# Altium project StepperDriverV2.PrjPcb
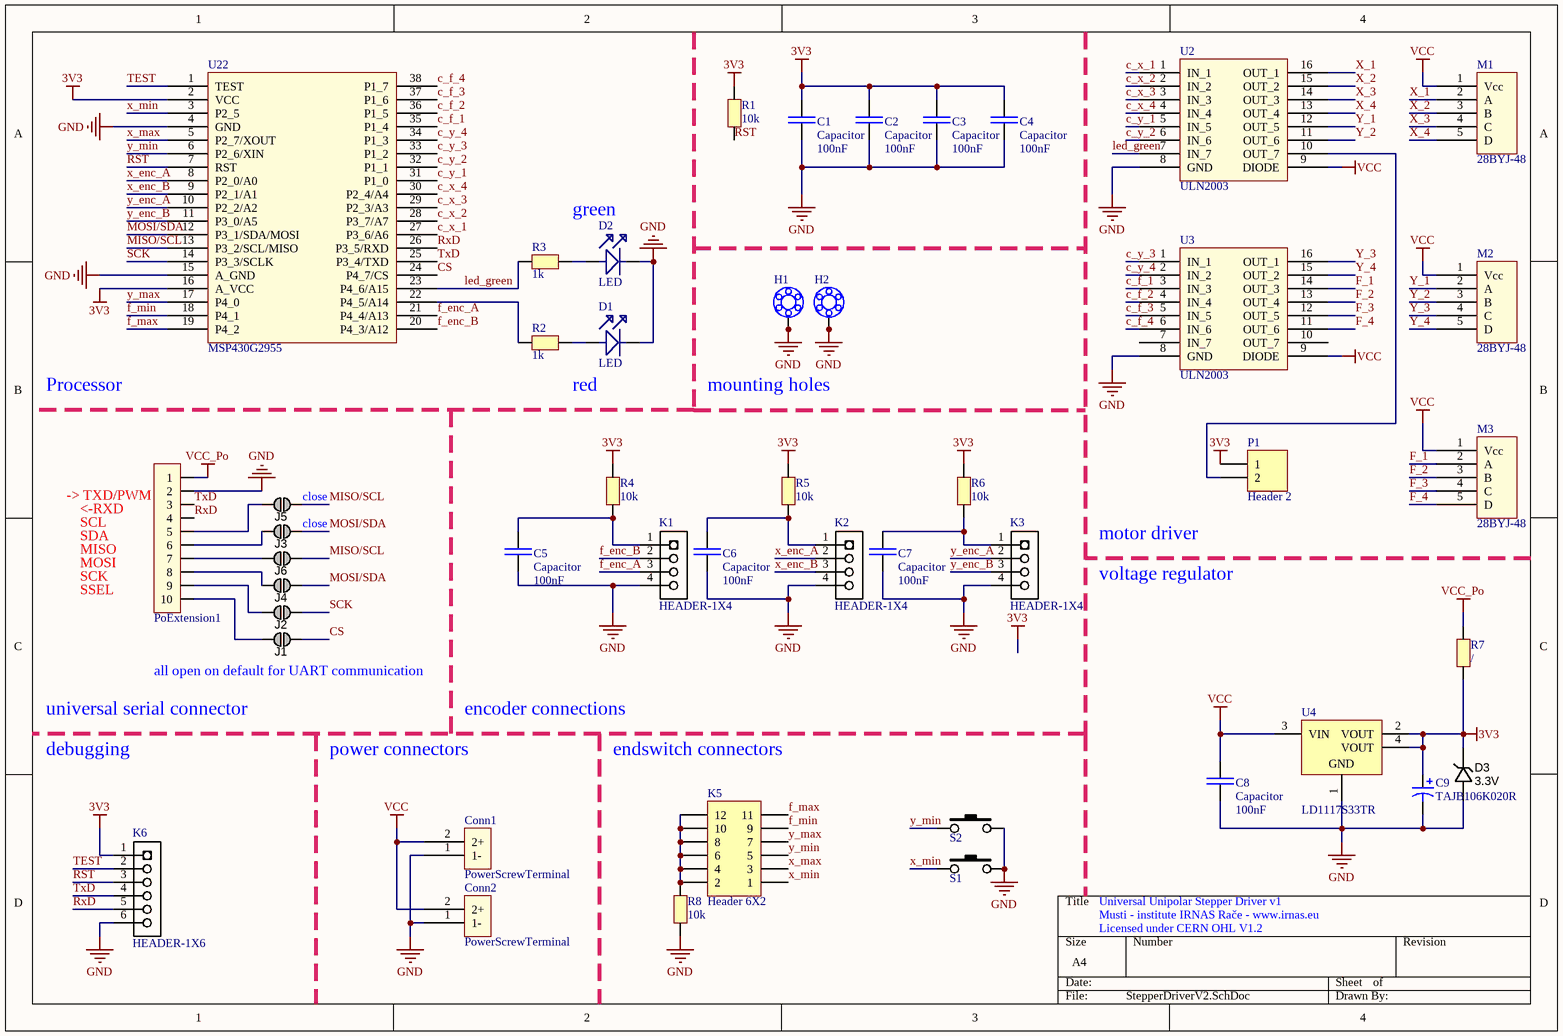
[diagram p0: StepperDriverV2.SchDoc]
1 sheet, 46 parts. Net scope: global (net labels, ports and power ports of the same name join across sheets).
Board file: StepperDriverV2.PcbDoc

## Sheet StepperDriverV2.SchDoc
size A4

### Parts
C1  Capacitor  value 100nF  [0603]
C2  Capacitor  value 100nF  [0603]
C3  Capacitor  value 100nF  [0603]
C4  Capacitor  value 100nF  [0603]
C5  Capacitor  value 100nF  [0603]
C6  Capacitor  value 100nF  [0603]
C7  Capacitor  value 100nF  [0603]
C8  Capacitor  value 100nF  [0603]
C9  TAJB106K020R  [AVX-CAPC3528_V]
Conn1  PowerScrewTerminal  [MKDSN 2,5/ 2-5,08 and powercon]
Conn2  PowerScrewTerminal  [MKDSN 2,5/ 2-5,08 and powercon]
D1  LED  [RESC2012X06N]
D2  LED  [RESC2012X06N]
D3  3.3V  [SOD323]
H1  M  [MOUNTING]  (value not drawn)  (no BOM)
H2  M  [MOUNTING]  (value not drawn)  (no BOM)
J1  Jumper  [JUMP1]  (value not drawn)  (no BOM)
J2  Jumper  [JUMP1]  (value not drawn)  (no BOM)
J3  Jumper  [JUMP1]  (value not drawn)  (no BOM)
J4  Jumper  [JUMP1]  (value not drawn)  (no BOM)
J5  Jumper  [JUMP1]  (value not drawn)  (no BOM)
J6  Jumper  [JUMP1]  (value not drawn)  (no BOM)
K1  HEADER-1X4  [HEADER-1X4]
K2  HEADER-1X4  [HEADER-1X4]
K3  HEADER-1X4  [HEADER-1X4]
K5  Header 6X2  [HDR2X6]
K6  HEADER-1X6  [HEADER-1X6]
M1  28BYJ-48  [XHP-5]
M2  28BYJ-48  [XHP-5]
M3  28BYJ-48  [XHP-5]
P1  Header 2  [HDR1X2]
PoExtension1  (no value)  [8-188275-0]
R1  10k  [0603]
R2  1k  [0603]
R3  1k  [0603]
R4  10k  [0603]
R5  10k  [0603]
R6  10k  [0603]
R7  /  [0603]
R8  10k  [0603]
S1  SW_THT_ANGLE  [TACT_Angle]  (value not drawn)
S2  SW_THT_ANGLE  [TACT_Angle]  (value not drawn)
U2  ULN2003  [SO-16 narrow]
U3  ULN2003  [SO-16 narrow]
U4  LD1117S33TR  [SOT-223_L]
U22  MSP430G2955  [R-PDSO-G38]

### Nets
3V3: C1.1 C2.1 C3.1 C4.1 C9.1 D3.K K6.1 P1.1 R1.2 R4.2 R5.2 R6.2 R7.1 U4.2(VOUT) U4.4(VOUT) U22.2(VCC) U22.16(A_VCC)
GND: C1.2 C2.2 C3.2 C4.2 C5.2 C6.2 C7.2 C8.2 C9.2 Conn1.1(1-) Conn2.1(1-) D1.2 D2.2 D3.A H1.1 H1.2 H1.3 H1.4 H1.5 H1.6 H1.7 H2.1 H2.2 H2.3 H2.4 H2.5 H2.6 H2.7 K1.4 K2.4 K3.4 K6.6 PoExtension1.2 R8.2 S1.2 S2.2 U2.8(GND) U3.8(GND) U4.1(GND) U22.4(GND) U22.15(A_GND)
VCC: C8.1 Conn1.2(2+) Conn2.2(2+) M1.1(Vcc) M2.1(Vcc) M3.1(Vcc) U2.9(DIODE) U3.9(DIODE) U4.3(VIN)
VCC_Po: PoExtension1.1 R7.2
c_f_1: U3.3(IN_3) U22.35(P1_4)
c_f_2: U3.4(IN_4) U22.36(P1_5)
c_f_3: U3.5(IN_5) U22.37(P1_6)
c_f_4: U3.6(IN_6) U22.38(P1_7)
c_x_1: U2.1(IN_1) U22.27(P3_6/A6)
c_x_2: U2.2(IN_2) U22.28(P3_7/A7)
c_x_3: U2.3(IN_3) U22.29(P2_3/A3)
c_x_4: U2.4(IN_4) U22.30(P2_4/A4)
c_y_1: U2.5(IN_5) U22.31(P1_0)
c_y_2: U2.6(IN_6) U22.32(P1_1)
c_y_3: U3.1(IN_1) U22.33(P1_2)
c_y_4: U3.2(IN_2) U22.34(P1_3)
CS: J1.2 U22.24(P4_7/CS)
F_1: M3.2(A) U3.14(OUT_3)
F_2: M3.3(B) U3.13(OUT_4)
F_3: M3.4(C) U3.12(OUT_5)
F_4: M3.5(D) U3.11(OUT_6)
f_enc_A: K1.3 U22.21(P4_4/A13)
f_enc_B: K1.2 U22.20(P4_3/A12)
f_max: K5.11 U22.19(P4_2)
f_min: K5.9 U22.18(P4_1)
led_green: R3.2 U2.7(IN_7) U22.23(P4_6/A15)
MISO/SCL: J5.1 J6.1 U22.13(P3_2/SCL/MISO)
MOSI/SDA: J3.1 J4.1 U22.12(P3_1/SDA/MOSI)
RST: K6.3 R1.1 U22.7(RST)
RxD: K6.5 PoExtension1.4 U22.26(P3_5/RXD)
SCK: J2.2 U22.14(P3_3/SCLK)
TEST: K6.2 U22.1(TEST)
TxD: K6.4 PoExtension1.3 U22.25(P3_4/TXD)
X_1: M1.2(A) U2.16(OUT_1)
X_2: M1.3(B) U2.15(OUT_2)
X_3: M1.4(C) U2.14(OUT_3)
X_4: M1.5(D) U2.13(OUT_4)
x_enc_A: K2.2 U22.8(P2_0/A0)
x_enc_B: K2.3 U22.9(P2_1/A1)
x_max: K5.3 U22.5(P2_7/XOUT)
x_min: K5.1 S1.1 U22.3(P2_5)
Y_1: M2.2(A) U2.12(OUT_5)
Y_2: M2.3(B) U2.11(OUT_6)
Y_3: M2.4(C) U3.16(OUT_1)
Y_4: M2.5(D) U3.15(OUT_2)
y_enc_A: K3.2 U22.10(P2_2/A2)
y_enc_B: K3.3 U22.11(P3_0/A5)
y_max: K5.7 U22.17(P4_0)
y_min: K5.5 S2.1 U22.6(P2_6/XIN)
NetC5_1: C5.1 K1.1 R4.1
NetC6_1: C6.1 K2.1 R5.1
NetC7_1: C7.1 K3.1 R6.1
NetD1_1: D1.1 R2.1
NetD2_1: D2.1 R3.1
NetJ1_1: J1.1 PoExtension1.10
NetJ2_1: J2.1 PoExtension1.9
NetJ3_2: J3.2 PoExtension1.6
NetJ4_2: J4.2 PoExtension1.8
NetJ5_2: J5.2 PoExtension1.5
NetJ6_2: J6.2 PoExtension1.7
NetK5_2: K5.2 K5.4 K5.6 K5.8 K5.10 K5.12 R8.1
NetP1_2: P1.2 U2.10(OUT_7)
NetR2_2: R2.2 U22.22(P4_5/A14)

Not connected (* = marked no-connect by the designer): U3 7(IN_7) 10(OUT_7)

### Notes on the sheet
- green
- Processor
- red
- mounting holes
- (near PoExtension1) -> TXD/PWM
- <-RXD
- (near J5) close
- SCL
- SDA
- MISO
- MOSI
- SCK
- close
- motor driver
- voltage regulator
- SSEL
- universal serial connector
- (near J1) all open on default for UART communication
- encoder connections
- debugging
- power connectors
- endswitch connectors
- Universal Unipolar Stepper Driver v1
- Musti - institute IRNAS Rače - www.irnas.eu
- Licensed under CERN OHL V1.2

### Library data of the parts
C1-C8 = Capacitor: General capacitor
C9 = CMP-0279-00001-1: Capacitor, Tantalum, 10uF 10% 20V MCCT-B (3528); Manufacturer: AVX; Polarity: Polarized; PartNumber: TAJB106K020R; PackageDescription: 2-Pin SMT Capacitor, 3.5 x 2.8 mm Body; ComponentLink1URL: http://www.avx.com/; PackageReference: CAPC3528; ComponentLink2Description: Datasheet; Capacitance: 10uF; Technology: Tantalum; ComponentLink2URL: http://www.avx.com/docs/Catalogs/taj.pdf; Tolerance: 10%; ComponentLink1Description: Manufacturer URL; Rated Voltage: 20V; DatasheetVersion: Jun-13; Mounting Technology: Surface Mount
D1 D2 = LED: LED diode
D3 = DIODE_ZENER_3V3_SOD323: Diode Zener SMD 3.3V 200mW SOD-323; Manufacturer 1: ON Semiconductor; Manufacturer Part Number 1: MM3Z3V3ST1G; Ratings: 3.3V; 0.2W; Vf=900mV @ 10mA; Material: Si; Tolerance: ±3%; SCDType: source; Package / Case: SOD-323; Diode Type: Zener; Supplier 1: Digi-Key; Supplier Part Number 1: MM3Z3V3ST1GOSCT-ND
H1 H2 = MOUNTING: MOUNTING HOLE - NON INSTALLABLE
J1-J6 = JUMP1: SMD jumper
K5 = Header 6X2: Header, 6-Pin, Dual row; LatestRevisionDate: 17-Jul-2002; LatestRevisionNote: Re-released for DXP Platform.; Publisher: Altium Limited
M1-M3 = 28BYJ-48: Stepper motor
P1 = Header 2: Header, 2-Pin; LatestRevisionDate: 17-Jul-2002; LatestRevisionNote: Re-released for DXP Platform.; Publisher: Altium Limited
PoExtension1 = 1-215079-0: Micro-Match female PCB connector 10 Positions THT
R1-R8 = Resistor: Resistor 0805 smd
U2 U3 = ULN2003: Darlington array
U4 = CMP-0244-00310-1: Fixed Low Drop Positive Voltage Regulator, 3.3V, 4-Pin SOT-223, Tape and Reel; ComponentLink2Description: Datasheet; PackageDescription: 4-Pin SOT-223 Package, 6.5 x 3.5 mm Body, 2.3 mm Pitch, 7 mm Lead Span; PackageVersion: 2010; ComponentLink2URL: http://www.st.com/internet/com/TECHNICAL_RESOURCES/TECHNICAL_LITERATURE/DATASHEET/CD00000544.pdf; PackageReference: SOT-223; DatasheetVersion: 1/11/2011; ComponentLink1Description: Manufacturer URL; ComponentLink1URL: http://www.st.com
K1-K3 = HEADER-1X4: Supplier 1: Digi-Key; Supplier Part Number 1: S1011E-36-ND
K6 = HEADER-1X6: Supplier 1: Digi-Key; Supplier Part Number 1: S1011E-36-ND